# Altium schematic sheet Safety_2019_V_3_0_Connectors.SchDoc
size A
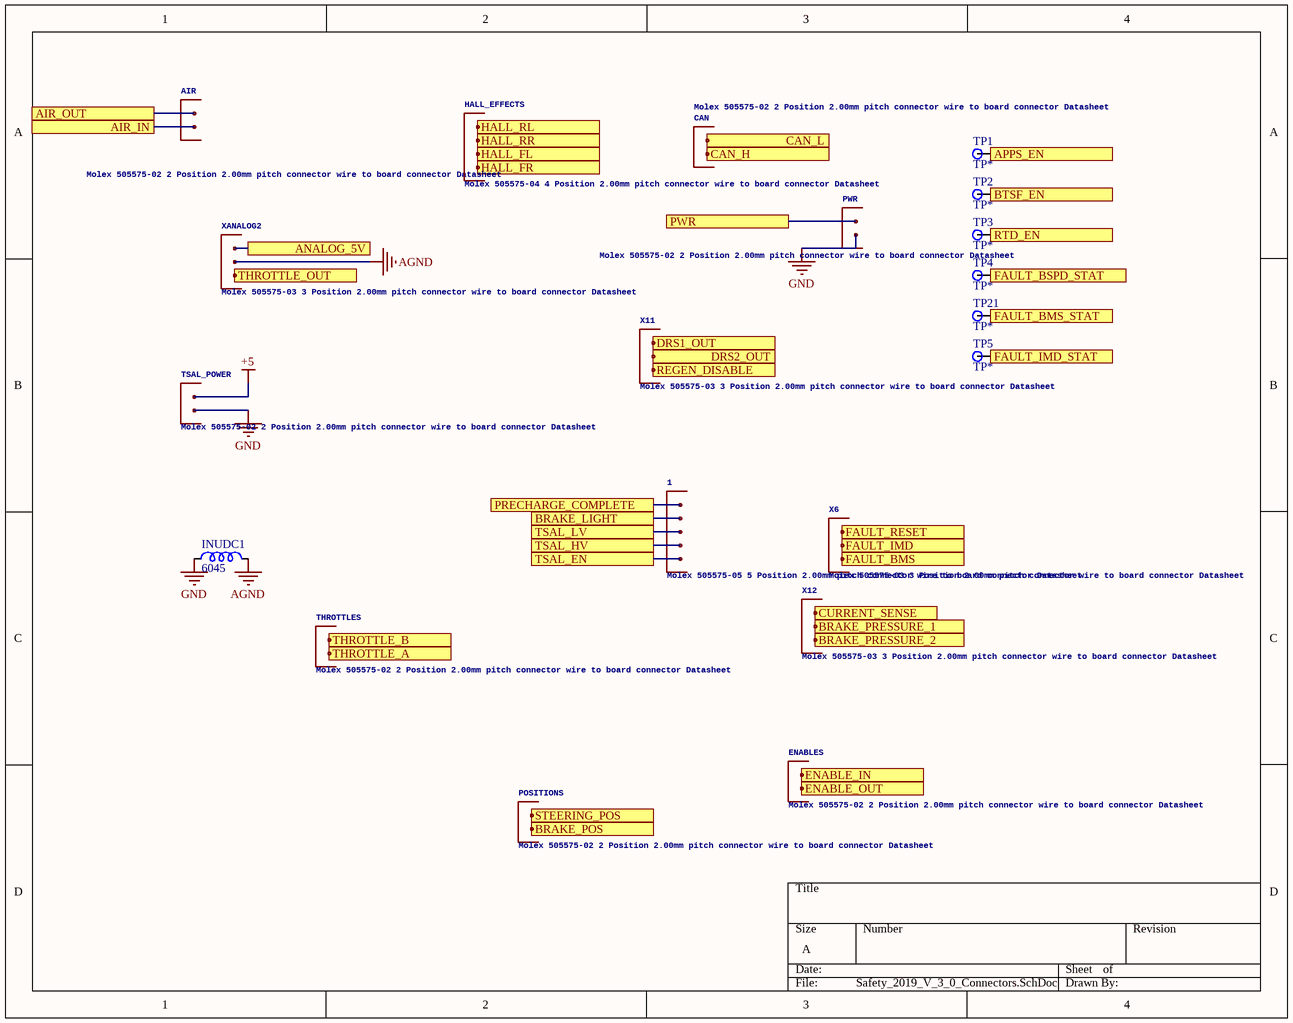
[diagram p0: Safety_2019_V_3_0_Connectors.SchDoc]

## Parts
1  Molex 505575-05 5 Position 2.00mm pitch connector wire to board connector Datasheet  [505575-05]
AIR  Molex 505575-02 2 Position 2.00mm pitch connector wire to board connector Datasheet  [505575-02]
CAN  Molex 505575-02 2 Position 2.00mm pitch connector wire to board connector Datasheet  [505575-02]
ENABLES  Molex 505575-02 2 Position 2.00mm pitch connector wire to board connector Datasheet  [505575-02]
HALL_EFFECTS  Molex 505575-04 4 Position 2.00mm pitch connector wire to board connector Datasheet  [505575-04]
INUDC1  6045  [IND-6045]
POSITIONS  Molex 505575-02 2 Position 2.00mm pitch connector wire to board connector Datasheet  [505575-02]
PWR  Molex 505575-02 2 Position 2.00mm pitch connector wire to board connector Datasheet  [505575-02]
THROTTLES  Molex 505575-02 2 Position 2.00mm pitch connector wire to board connector Datasheet  [505575-02]
TP1  TP*  [Testpoint]
TP2  TP*  [Testpoint]
TP3  TP*  [Testpoint]
TP4  TP*  [Testpoint]
TP5  TP*  [Testpoint]
TP21  TP*  [Testpoint]
TSAL_POWER  Molex 505575-02 2 Position 2.00mm pitch connector wire to board connector Datasheet  [505575-02]
X6  Molex 505575-03 3 Position 2.00mm pitch connector wire to board connector Datasheet  [505575-03]
X11  Molex 505575-03 3 Position 2.00mm pitch connector wire to board connector Datasheet  [505575-03]
X12  Molex 505575-03 3 Position 2.00mm pitch connector wire to board connector Datasheet  [505575-03]
XANALOG2  Molex 505575-03 3 Position 2.00mm pitch connector wire to board connector Datasheet  [505575-03]

## Ports
AIR_IN, AIR_OUT, ANALOG_5V, APPS_EN, BRAKE_LIGHT, BRAKE_POS, BRAKE_PRESSURE_1, BRAKE_PRESSURE_2, BTSF_EN, CAN_H, CAN_L, CURRENT_SENSE, DRS1_OUT, DRS2_OUT, ENABLE_IN, ENABLE_OUT, FAULT_BMS, FAULT_BMS_STAT, FAULT_BSPD_STAT, FAULT_IMD, FAULT_IMD_STAT, FAULT_RESET, HALL_FL, HALL_FR, HALL_RL, HALL_RR, PRECHARGE_COMPLETE, PWR, REGEN_DISABLE, RTD_EN, STEERING_POS, THROTTLE_A, THROTTLE_B, THROTTLE_OUT, TSAL_EN, TSAL_HV, TSAL_LV

## Nets
+5: TSAL_POWER.1
AGND: INUDC1.2 XANALOG2.2
GND: INUDC1.1 PWR.2 TSAL_POWER.2
AIR_IN: AIR.2 ; port AIR_IN
AIR_OUT: AIR.1 ; port AIR_OUT
ANALOG_5V: XANALOG2.1 ; port ANALOG_5V
APPS_EN: TP1.1 ; port APPS_EN
BRAKE_LIGHT: 1.2 ; port BRAKE_LIGHT
BRAKE_POS: POSITIONS.2 ; port BRAKE_POS
BRAKE_PRESSURE_1: X12.2 ; port BRAKE_PRESSURE_1
BRAKE_PRESSURE_2: X12.3 ; port BRAKE_PRESSURE_2
BTSF_EN: TP2.1 ; port BTSF_EN
CAN_H: CAN.2 ; port CAN_H
CAN_L: CAN.1 ; port CAN_L
CURRENT_SENSE: X12.1 ; port CURRENT_SENSE
DRS1_OUT: X11.1 ; port DRS1_OUT
DRS2_OUT: X11.2 ; port DRS2_OUT
ENABLE_IN: ENABLES.1 ; port ENABLE_IN
ENABLE_OUT: ENABLES.2 ; port ENABLE_OUT
FAULT_BMS: X6.3 ; port FAULT_BMS
FAULT_BMS_STAT: TP21.1 ; port FAULT_BMS_STAT
FAULT_BSPD_STAT: TP4.1 ; port FAULT_BSPD_STAT
FAULT_IMD: X6.2 ; port FAULT_IMD
FAULT_IMD_STAT: TP5.1 ; port FAULT_IMD_STAT
FAULT_RESET: X6.1 ; port FAULT_RESET
HALL_FL: HALL_EFFECTS.3 ; port HALL_FL
HALL_FR: HALL_EFFECTS.4 ; port HALL_FR
HALL_RL: HALL_EFFECTS.1 ; port HALL_RL
HALL_RR: HALL_EFFECTS.2 ; port HALL_RR
PRECHARGE_COMPLETE: 1.1 ; port PRECHARGE_COMPLETE
PWR: PWR.1 ; port PWR
REGEN_DISABLE: X11.3 ; port REGEN_DISABLE
RTD_EN: TP3.1 ; port RTD_EN
STEERING_POS: POSITIONS.1 ; port STEERING_POS
THROTTLE_A: THROTTLES.2 ; port THROTTLE_A
THROTTLE_B: THROTTLES.1 ; port THROTTLE_B
THROTTLE_OUT: XANALOG2.3 ; port THROTTLE_OUT
TSAL_EN: 1.5 ; port TSAL_EN
TSAL_HV: 1.4 ; port TSAL_HV
TSAL_LV: 1.3 ; port TSAL_LV

## Library data of the parts
1 = 505575-05: GateName_1: G$1; SymbolName_1: 5POS; LibraryName: MOLEX Micro-Lock; DeviceSetName: 505575-05; Package: 505575-05
AIR CAN ENABLES POSITIONS PWR THROTTLES TSAL_POWER = 505575-02: GateName_1: G$1; SymbolName_1: 2POS; LibraryName: MOLEX Micro-Lock; DeviceSetName: 505575-02; Package: 505575-02
HALL_EFFECTS = 505575-04: GateName_1: G$1; SymbolName_1: 4POS; LibraryName: MOLEX Micro-Lock; DeviceSetName: 505575-04; Package: 505575-04
INUDC1 = IND-6045
TP1-TP5 TP21 = Testpoint
X6 X11 X12 XANALOG2 = 505575-03: GateName_1: G$1; SymbolName_1: 3POS; LibraryName: MOLEX Micro-Lock; DeviceSetName: 505575-03; Package: 505575-03